# Altium schematic sheet Sheet2.SchDoc
size B; SheetNumber: 1; SheetTotal: 1
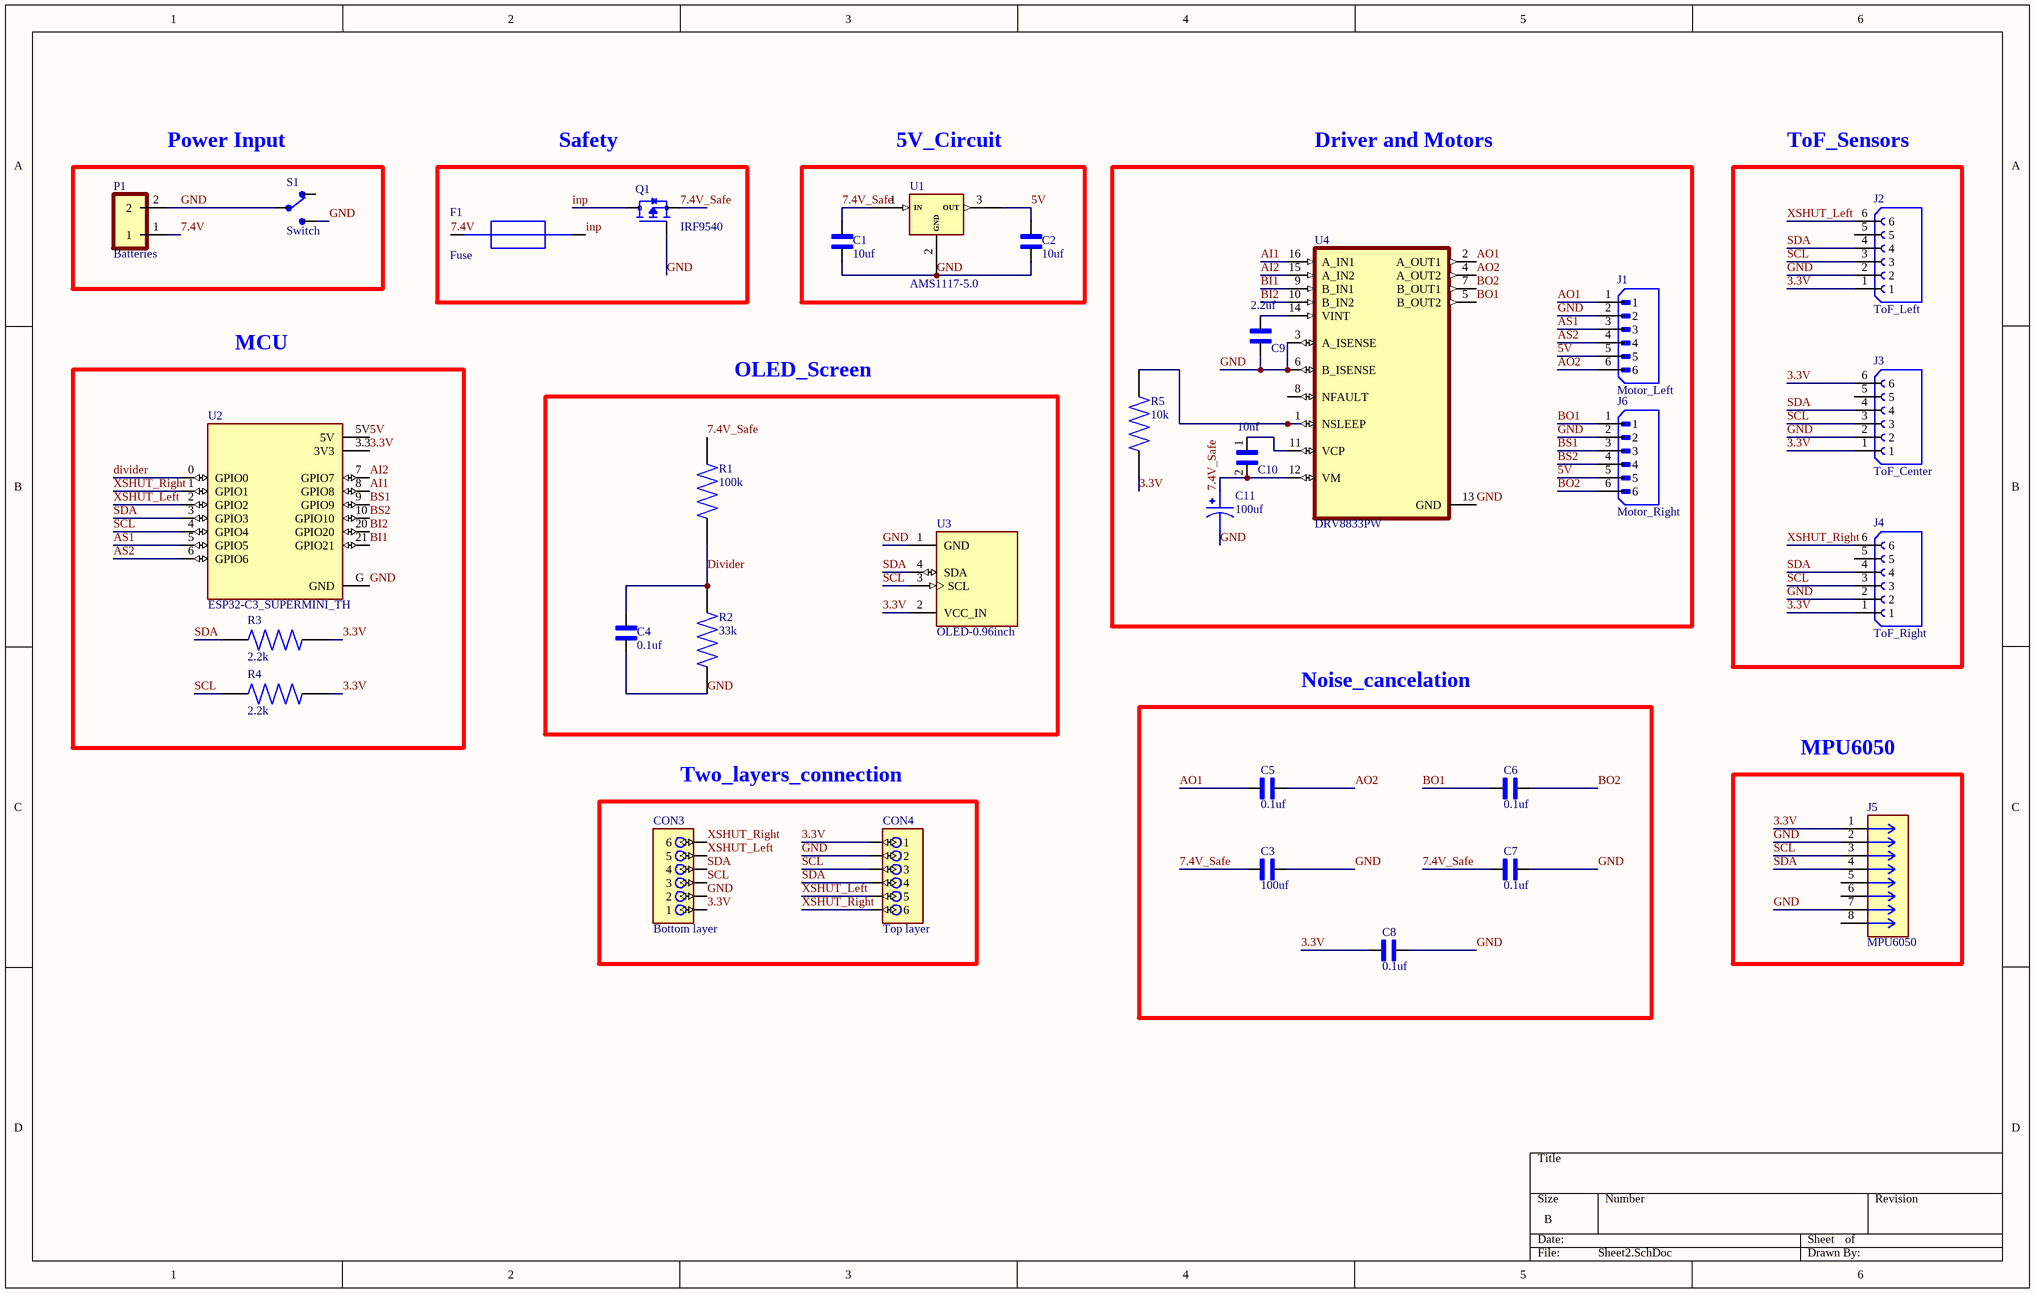
[diagram p0: Sheet2.SchDoc]

## Parts
C1  10uf  [CAP_ECHU1H181GX5]
C2  10uf  [CAP_ECHU1H181GX5]
C3  100uf  [CAPC3225X280N]
C4  0.1uf  [CAP_ECHU1H181GX5]
C5  0.1uf  [CAP_ECHU1H181GX5]
C6  0.1uf  [CAP_ECHU1H181GX5]
C7  0.1uf  [CAPC3225X280N]
C8  0.1uf  [CAPC3225X280N]
C9  2.2uf  [CAPC2012X88N]
C10  10nf  [CAPC3216X180N]
C11  100uf  [CAPMP3216X180N]
CON3  Bottom layer  [6 pin JST]
CON4  Top layer  [6 pin JST]
F1  Fuse  [FUSC3216X75N]
J1  Motor_Left  [JST_B6B-XH-A]
J2  ToF_Left  [6 pin female header]
J3  ToF_Center  [6 pin female header]
J4  ToF_Right  [6 pin female header]
J5  MPU6050  [8 Pin Female Headers]
J6  Motor_Right  [JST_B6B-XH-A]
P1  Batteries  [Green Terminal]
Q1  IRF9540  [TO254P1052X465X1989-3]
R1  100k  [SMD R]
R2  33k  [SMD R]
R3  2.2k  [SMD R]
R4  2.2k  [SMD R]
R5  10k  [RESC2012X60N]
S1  Switch  [SW_1101M2S3CQE2]
U1  AMS1117-5.0  [5V Regulator]
U2  ESP32-C3_SUPERMINI_TH  [MODULE_ESP32-C3_SUPERMINI_TH]
U3  OLED-0.96inch  [MODULE_DM-OLED096-636]
U4  DRV8833PW  [SOP65P640X120-16N]

## Blocks framed on the sheet
Power Input: P1 S1
Safety: F1 Q1
5V_Circuit: C1 C2 U1
Driver and Motors: C9-C11 J1 J6 R5 U4
ToF_Sensors: J2-J4
MCU: R3 R4 U2
OLED_Screen: C4 R1 R2 U3
Noise_cancelation: C3 C5-C8
MPU6050: J5
Two_layers_connection: CON3 CON4

## Nets
3.3V: C8.1 CON3.1 CON4.1 J2.1 J3.1 J3.6 J4.1 J5.1 R3.2 R4.2 R5.1 U2.3.3(3V3) U3.2(VCC_IN)
5V: C2.2 J1.5 J6.5 U1.3(OUT) U2.5V
7.4V: F1.1 P1.1
7.4V_Safe: C1.2 C3.1 C7.1 C10.2 C11.1 Q1.3(S) R1.1 U1.1(IN) U4.12(VM)
AI1: U2.8(GPIO8) U4.16(A_IN1)
AI2: U2.7(GPIO7) U4.15(A_IN2)
AO1: C5.2 J1.1 U4.2(A_OUT1)
AO2: C5.1 J1.6 U4.4(A_OUT2)
AS1: J1.3 U2.5(GPIO5)
AS2: J1.4 U2.6(GPIO6)
BI1: U2.21(GPIO21) U4.9(B_IN1)
BI2: U2.20(GPIO20) U4.10(B_IN2)
BO1: C6.2 J6.1 U4.5(B_OUT2)
BO2: C6.1 J6.6 U4.7(B_OUT1)
BS1: J6.3 U2.9(GPIO9)
BS2: J6.4 U2.10(GPIO10)
Divider: C4.2 R1.2 R2.1 U2.0(GPIO0)
GND: C1.1 C2.1 C3.2 C4.1 C7.2 C8.2 C9.2 C11.2 CON3.2 CON4.2 J1.2 J2.2 J3.2 J4.2 J5.2 J5.7 J6.2 P1.2 Q1.1(G) R2.2 S1.2 S1.3 U1.2(GND) U2.G(GND) U3.1(GND) U4.3(A_ISENSE) U4.6(B_ISENSE) U4.13(GND)
inp: F1.2 Q1.2(D)
SCL: CON3.3 CON4.3 J2.3 J3.3 J4.3 J5.3 R4.1 U2.4(GPIO4) U3.3(SCL)
SDA: CON3.4 CON4.4 J2.4 J3.4 J4.4 J5.4 R3.1 U2.3(GPIO3) U3.4(SDA)
XSHUT_Left: CON3.5 CON4.5 J2.6 U2.2(GPIO2)
XSHUT_Right: CON3.6 CON4.6 J4.6 U2.1(GPIO1)
NetC9_1: C9.1 U4.14(VINT)
NetC10_1: C10.1 U4.11(VCP)
NetR5_2: R5.2 U4.1(NSLEEP)

Not connected (* = marked no-connect by the designer): J2 5; J3 5; J4 5; J5 5 6 8; S1 1; U4 8(NFAULT)

## Library data of the parts
C1 C2 C4-C6 = ECHU1H181GX5: Capacitor Pps Film, 180pf, 50v, 2%, 0805capacitor Pps Film, 180pf, 50v, 2%, 0805; MF: Panasonic; Digi-Key_Part_Number: PCF1287TR-ND; SnapEDA_Link: https://www.snapeda.com/parts/ECHU1H181GX5/Panasonic/view-part/?ref=snap; Check_prices: https://www.snapeda.com/parts/ECHU1H181GX5/Panasonic/view-part/?ref=eda; Package: 0805-2 Panasonic; Purchase-URL: https://pricing.snapeda.com/search/part/ECHU1H181GX5/?ref=eda; MP: ECHU1H181GX5; Value: *
C3 C7 C8 = CL32A107MQVNNWE: 100 ÂµF Â±20% 6.3V Ceramic Capacitor X5R 1210 (3225 Metric); MF: Samsung; SnapEDA_Link: https://www.snapeda.com/parts/CL32A107MQVNNWE/Samsung/view-part/?ref=snap; Package: SMD-2 Samsung; Value: *; MP: CL32A107MQVNNWE; Check_prices: https://www.snapeda.com/parts/CL32A107MQVNNWE/Samsung/view-part/?ref=eda
C9 = C0805C473K1RACTU: 0805 X7R ceramic capacitor,47nF 100V | KEMET C0805C473K1RACTU; SnapEDA_Link: https://www.snapeda.com/parts/C0805C473K1RACTU/KEMET/view-part/?ref=snap; Package: 805-2 KEMET; Value: *; MF: KEMET; MP: C0805C473K1RACTU; Check_prices: https://www.snapeda.com/parts/C0805C473K1RACTU/KEMET/view-part/?ref=eda
C10 = C3216NP02J103J160AA: C Series 1206 10 nF 630 V Â±5 % Tolerance NP0 SMT Multilayer Ceramic Capacitor; MF: TDK; Package: 3216 TDK; Value: *; Purchase-URL: https://pricing.snapeda.com/search/part/C3216NP02J103J160AA/?ref=eda; Availability: In Stock; MP: C3216NP02J103J160AA; Check_prices: https://www.snapeda.com/parts/C3216NP02J103J160AA/TDK/view-part/?ref=eda; SnapEDA_Link: https://www.snapeda.com/parts/C3216NP02J103J160AA/TDK/view-part/?ref=snap; Price: None
C11 = TAJA106M010RNJ: Capacitor;Tantalum;Cap 10uF;Tol 20%;SMT;Vol-Rtg 10V;Code 3216;TR | AVX TAJA106M010RNJ; SnapEDA_Link: https://www.snapeda.com/parts/TAJA106M010RNJ/AVX/view-part/?ref=snap; Package: 1206 AVX; Value: *; MF: AVX; MP: TAJA106M010RNJ; Check_prices: https://www.snapeda.com/parts/TAJA106M010RNJ/AVX/view-part/?ref=eda
CON3 CON4 = 6 pin JST: Connector Header Surface Mount 6 position 0.059 (1.50mm); MF: JST; MP: B6B-ZR; SnapEDA_Link: https://www.snapeda.com/parts/B6B-ZR/JST/view-part/?ref=snap; Package: None; Value: *; Check_prices: https://www.snapeda.com/parts/B6B-ZR/JST/view-part/?ref=eda
F1 = 1206L035YR: Polymeric PTC Resettable Fuse 12V 1.5 A Ih Surface Mount 1206 (3216 Metric), Concave; MF: Littelfuse Inc.; SnapEDA_Link: https://www.snapeda.com/parts/1206L035YR/Littelfuse/view-part/?ref=snap; Package: 1206 Littelfuse; Value: *; MP: 1206L035YR; Check_prices: https://www.snapeda.com/parts/1206L035YR/Littelfuse/view-part/?ref=eda
J1 J6 = B6B-XH-A: MF: {'manufacturer': u'JST Sales America Inc.'}; Package: None; Price: None; Value: *; MP: B6B-XH-A; Availability: Unavailable
J2-J4 = 6 pin female header: MF: Sullins Connector Solutions; MP: PPTC061LFBNRC; SnapEDA_Link: https://www.snapeda.com/parts/PPTC061LFBNRC/Sullins/view-part/?ref=snap; Package: None; Value: *; Check_prices: https://www.snapeda.com/parts/PPTC061LFBNRC/Sullins/view-part/?ref=eda
J5 = 8 pin Female Headers: MP: 395011008; Package: None; Price: None; Value: *; Availability: Unavailable
P1 = Green Terminal: Ð Ð°Ð·ÑŠÐµÐ¼Ð½Ñ‹Ðµ ÐºÐ»ÐµÐ¼Ð¼Ð½Ñ‹Ðµ ÐºÐ¾Ð»Ð¾Ð´ÐºÐ¸ Ð Ð¾Ð·ÐµÑ‚ÐºÐ° 2 Ð¿Ð¾Ð»Ð¾Ð¶ÐµÐ½Ð¸Ñ 5,08 Ð¼Ð¼ ÐŸÑ€Ð¸Ð¿Ð¾Ð¹ Ð¿Ñ€ÑÐ¼Ð¾Ð¹ Ñ‡ÐµÑ€ÐµÐ· Ð¾Ñ‚Ð²ÐµÑ€ÑÑ‚Ð¸Ðµ 13,5 Ð / ÐºÐ¾Ð½Ñ‚Ð°ÐºÑ‚; MF: TE Connectivity; MP: 282837-2; SnapEDA_Link: https://www.snapeda.com/parts/282837-2/TE+Connectivity+AMP+Connectors/view-part/?ref=snap; Price: None; Check_prices: https://www.snapeda.com/parts/282837-2/TE+Connectivity+AMP+Connectors/view-part/?ref=eda; Purchase-URL: https://pricing.snapeda.com/search/part/282837-2/?ref=eda; Value: *; Availability: In Stock; Package: None
Q1 = IRF9540: P-Channel 100 V 19A (Tc) 3.7W (Ta), 150W (Tc) Surface Mount DÂ²PAK (TO-263); MF: Vishay; SnapEDA_Link: https://www.snapeda.com/parts/IRF9540/Vishay+Siliconix/view-part/?ref=snap; Package: TO-220-3 Vishay; Value: *; MP: IRF9540; Check_prices: https://www.snapeda.com/parts/IRF9540/Vishay+Siliconix/view-part/?ref=eda
R1-R4 = SMD R 0805: MP: ERJU06F91R0V; Availability: Unavailable; Price: None; Value: *; Package: None
R5 = RC0805JR-0739RL: Surface Mount Thick Film Resistor, RC Series, 39 ohm, 125 mW, - 5%, 150 V, 0805 [2012 Metric]; MF: Yageo; SnapEDA_Link: https://www.snapeda.com/parts/RC0805JR-0739RL/Yageo/view-part/?ref=snap; Package: 2012 Yageo; Value: *; MP: RC0805JR-0739RL; Check_prices: https://www.snapeda.com/parts/RC0805JR-0739RL/Yageo/view-part/?ref=eda
S1 = 1101M2S3CQE2: Switch,Slide,Sealed,SPDT,ON-NONE-ON,PC Mnt,.200 Blk Act,6A,120VAC,PC Thru-Hole | C&K 1101M2S3CQE2; SnapEDA_Link: https://www.snapeda.com/parts/1101M2S3CQE2/C%2526K/view-part/?ref=snap; Package: None; Value: *; MF: C&K; MP: 1101M2S3CQE2; Check_prices: https://www.snapeda.com/parts/1101M2S3CQE2/C%2526K/view-part/?ref=eda
U1 = 5V Regulator
U2 = ESP32-C3_SUPERMINI_TH: Super tiny ESP32-C3 board; MF: Espressif Systems; MP: ESP32-C3 SuperMini_TH; SnapEDA_Link: https://www.snapeda.com/parts/ESP32-C3%20SuperMini_TH/Espressif+Systems/view-part/?ref=snap; Package: Package; Value: *; Check_prices: https://www.snapeda.com/parts/ESP32-C3%20SuperMini_TH/Espressif+Systems/view-part/?ref=eda
U3 = DM-OLED096-636: 0.96â€ 128 X 64 MONOCHROME GRAPHIC OLED DISPLAY MODULE - I2C; SnapEDA_Link: https://www.snapeda.com/parts/DM-OLED096-636/Display+Module/view-part/?ref=snap; Package: Package; Value: *; MF: Display Module; MP: DM-OLED096-636; Check_prices: https://www.snapeda.com/parts/DM-OLED096-636/Display+Module/view-part/?ref=eda
U4 = DRV8833PW: 10.8-V, 2-A dual H-bridge motor driver with current regulation; MF: Texas Instruments; SnapEDA_Link: https://www.snapeda.com/parts/DRV8833PW/Texas+Instruments/view-part/?ref=snap; Package: TSSOP-16 Texas Instruments; Value: *; MP: DRV8833PW; Check_prices: https://www.snapeda.com/parts/DRV8833PW/Texas+Instruments/view-part/?ref=eda